# EasyEDA schematic pcb_schematic.json
TITLE: Space Modulation Project PCB Schematic; REV: 1.0; Date: 2024-11-21; Sheet: 1/1; Drawn By: sahelalsharu; Company: Your Company
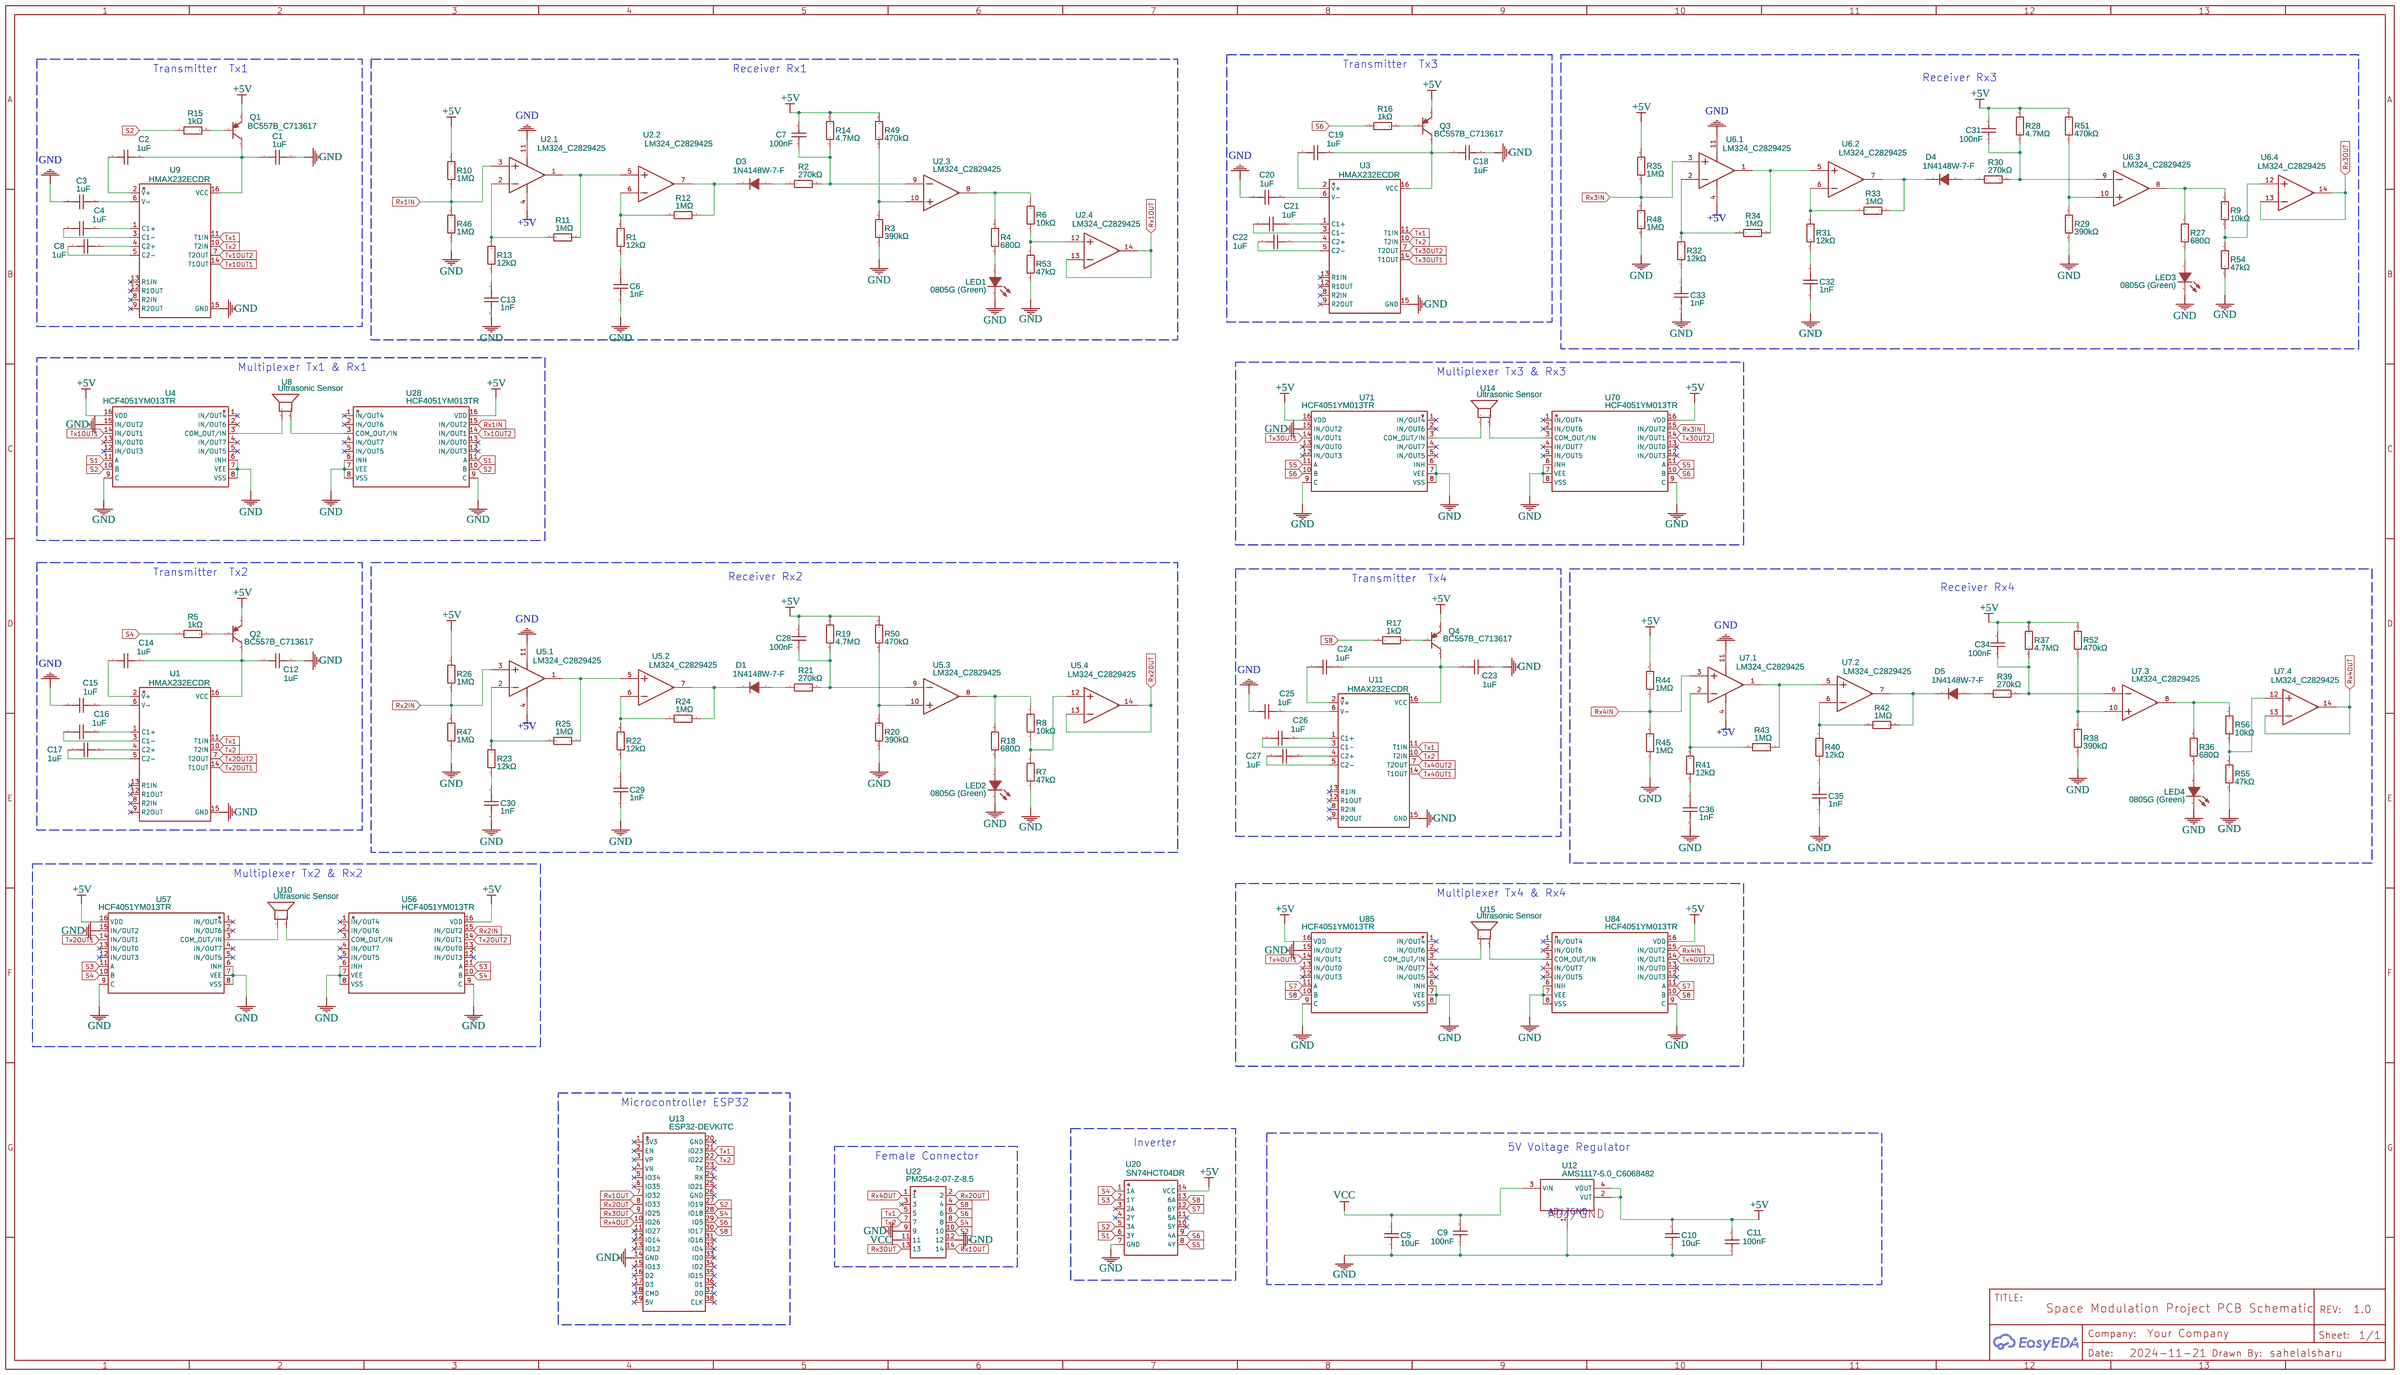
[diagram p0: schematic sheet]

## Parts
C1  1uF  [C1206]
C2  1uF  [C1206]
C3  1uF  [C1206]
C4  1uF  [C1206]
C5  10uF  [C1206]
C6  1nF  [C0805]
C7  100nF  [C0805]
C8  1uF  [C1206]
C9  100nF  [C0805]
C10  10uF  [C1206]
C11  100nF  [C0805]
C12  1uF  [C1206]
C13  1nF  [C0805]
C14  1uF  [C1206]
C15  1uF  [C1206]
C16  1uF  [C1206]
C17  1uF  [C1206]
C18  1uF  [C1206]
C19  1uF  [C1206]
C20  1uF  [C1206]
C21  1uF  [C1206]
C22  1uF  [C1206]
C23  1uF  [C1206]
C24  1uF  [C1206]
C25  1uF  [C1206]
C26  1uF  [C1206]
C27  1uF  [C1206]
C28  100nF  [C0805]
C29  1nF  [C0805]
C30  1nF  [C0805]
C31  100nF  [C0805]
C32  1nF  [C0805]
C33  1nF  [C0805]
C34  100nF  [C0805]
C35  1nF  [C0805]
C36  1nF  [C0805]
D1  1N4148W-7-F  [SOD-123_L2.7-W1.6-LS3.7-RD-1]
D3  1N4148W-7-F  [SOD-123_L2.7-W1.6-LS3.7-RD-1]
D4  1N4148W-7-F  [SOD-123_L2.7-W1.6-LS3.7-RD-1]
D5  1N4148W-7-F  [SOD-123_L2.7-W1.6-LS3.7-RD-1]
LED1  0805G (Green)  [LED0805-R-RD]
LED2  0805G (Green)  [LED0805-R-RD]
LED3  0805G (Green)  [LED0805-R-RD]
LED4  0805G (Green)  [LED0805-R-RD]
Q1  BC557B_C713617  [TO-92-3_L4.9-W3.7-P1.27-L]
Q2  BC557B_C713617  [TO-92-3_L4.9-W3.7-P1.27-L]
Q3  BC557B_C713617  [TO-92-3_L4.9-W3.7-P1.27-L]
Q4  BC557B_C713617  [TO-92-3_L4.9-W3.7-P1.27-L]
R1  12kΩ  [R0805]
R2  270kΩ  [R0805]
R3  390kΩ  [R0805]
R4  680Ω  [R0805]
R5  1kΩ  [R0805]
R6  10kΩ  [R0805]
R7  47kΩ  [R0805]
R8  10kΩ  [R0805]
R9  10kΩ  [R0805]
R10  1MΩ  [R0805]
R11  1MΩ  [R0805]
R12  1MΩ  [R0805]
R13  12kΩ  [R0805]
R14  4.7MΩ  [R0805]
R15  1kΩ  [R0805]
R16  1kΩ  [R0805]
R17  1kΩ  [R0805]
R18  680Ω  [R0805]
R19  4.7MΩ  [R0805]
R20  390kΩ  [R0805]
R21  270kΩ  [R0805]
R22  12kΩ  [R0805]
R23  12kΩ  [R0805]
R24  1MΩ  [R0805]
R25  1MΩ  [R0805]
R26  1MΩ  [R0805]
R27  680Ω  [R0805]
R28  4.7MΩ  [R0805]
R29  390kΩ  [R0805]
R30  270kΩ  [R0805]
R31  12kΩ  [R0805]
R32  12kΩ  [R0805]
R33  1MΩ  [R0805]
R34  1MΩ  [R0805]
R35  1MΩ  [R0805]
R36  680Ω  [R0805]
R37  4.7MΩ  [R0805]
R38  390kΩ  [R0805]
R39  270kΩ  [R0805]
R40  12kΩ  [R0805]
R41  12kΩ  [R0805]
R42  1MΩ  [R0805]
R43  1MΩ  [R0805]
R44  1MΩ  [R0805]
R45  1MΩ  [R0805]
R46  1MΩ  [R0805]
R47  1MΩ  [R0805]
R48  1MΩ  [R0805]
R49  470kΩ  [R0805]
R50  470kΩ  [R0805]
R51  470kΩ  [R0805]
R52  470kΩ  [R0805]
R53  47kΩ  [R0805]
R54  47kΩ  [R0805]
R55  47kΩ  [R0805]
R56  10kΩ  [R0805]
U1  HMAX232ECDR  [SOP-16_L10.2-W3.9-P1.27-LS6.0-BL]
U2  LM324_C2829425  [SOP-14_L8.6-W3.9-P1.27-LS6.0-BL]  (sections 1,2,3,4)
U3  HMAX232ECDR  [SOP-16_L10.2-W3.9-P1.27-LS6.0-BL]
U4  HCF4051YM013TR  [SO-16_L10.0-W4.0-P1.27-LS6.2-BL]
U5  LM324_C2829425  [SOP-14_L8.6-W3.9-P1.27-LS6.0-BL]  (sections 1,2,3,4)
U6  LM324_C2829425  [SOP-14_L8.6-W3.9-P1.27-LS6.0-BL]  (sections 1,2,3,4)
U7  LM324_C2829425  [SOP-14_L8.6-W3.9-P1.27-LS6.0-BL]  (sections 1,2,3,4)
U8  Ultrasonic Sensor  [ULTRASONIC SENSOR FOOTPRINT]
U9  HMAX232ECDR  [SOP-16_L10.2-W3.9-P1.27-LS6.0-BL]
U10  Ultrasonic Sensor  [ULTRASONIC SENSOR FOOTPRINT]
U11  HMAX232ECDR  [SOP-16_L10.2-W3.9-P1.27-LS6.0-BL]
U12  AMS1117-5.0_C6068482  [SOT-223-4_L6.5-W3.5-P2.30-LS7.0-BR]
U13  ESP32-DEVKITC  [BULETM-SMD_ESP32-DEVKITC]
U14  Ultrasonic Sensor  [ULTRASONIC SENSOR FOOTPRINT]
U15  Ultrasonic Sensor  [ULTRASONIC SENSOR FOOTPRINT]
U20  SN74HCT04DR  [SOIC-14_L8.7-W3.9-P1.27-LS6.0-BL]
U22  PM254-2-07-Z-8.5  [HDR-TH_14P-P2.54-V-F-R2-C7-S2.54]
U28  HCF4051YM013TR  [SO-16_L10.0-W4.0-P1.27-LS6.2-BL]
U56  HCF4051YM013TR  [SO-16_L10.0-W4.0-P1.27-LS6.2-BL]
U57  HCF4051YM013TR  [SO-16_L10.0-W4.0-P1.27-LS6.2-BL]
U70  HCF4051YM013TR  [SO-16_L10.0-W4.0-P1.27-LS6.2-BL]
U71  HCF4051YM013TR  [SO-16_L10.0-W4.0-P1.27-LS6.2-BL]
U84  HCF4051YM013TR  [SO-16_L10.0-W4.0-P1.27-LS6.2-BL]
U85  HCF4051YM013TR  [SO-16_L10.0-W4.0-P1.27-LS6.2-BL]

## Library data of the parts
C1-C4 C8 C12 C14-C27 = 1206B105K500NT: Supplier: LCSC; Manufacturer: FH(风华); Supplier Part: C90539; JLCPCB Part Class: Extended Part; link: https://lcsc.com/eda_search?q=C90539&%26type=1&ref=editor
C5 C10 = CL31A106KBHNNNE: Supplier: LCSC; Manufacturer: SAMSUNG(三星); Supplier Part: C13585; JLCPCB Part Class: Basic Part; link: https://lcsc.com/eda_search?q=C13585&%26type=1&ref=editor
C6 C13 C29 C30 C32 C33 C35 C36 = CC0805KRX7R9BB102: Supplier: LCSC; Manufacturer: YAGEO(国巨); Supplier Part: C94121; JLCPCB Part Class: Extended Part
C7 C9 C11 C28 C31 C34 = 0805B104K500NT: Supplier: LCSC; Manufacturer: FH(风华); Supplier Part: C38141; JLCPCB Part Class: Extended Part
D1 D3-D5 = 1N4148W-7-F: Supplier: LCSC; Manufacturer: DIODES(美台); Supplier Part: C83528; JLCPCB Part Class: Extended Part
LED1-LED4 = 0805G (Green): Supplier: LCSC; Manufacturer: KENTO; Manufacturer Part: KT-0805G; Supplier Part: C2297; JLCPCB Part Class: Basic Part
Q1-Q4 = BC557B_C713617: Contributor: LCSC; Supplier: LCSC; Supplier Part: C713617; Manufacturer: LGE(鲁光); Manufacturer Part: BC557B; JLCPCB Part Class: Extended Part
R1 R13 R22 R23 R31 R32 R40 R41 = 0805W8F1202T5E: Supplier: LCSC; Manufacturer: UNI-ROYAL(厚声); Supplier Part: C17444; JLCPCB Part Class: Basic Part
R2 R21 R30 R39 = 0805W8F2703T5E: Supplier: LCSC; Manufacturer: UNI-ROYAL(厚声); Supplier Part: C17589; JLCPCB Part Class: Extended Part
R3 R20 R29 R38 = 0805W8F3903T5E: Supplier: LCSC; Manufacturer: UNI-ROYAL(厚声); Supplier Part: C17656; JLCPCB Part Class: Extended Part
R4 R18 R27 R36 = 0805W8F6800T5E: Supplier: LCSC; Manufacturer: UNI-ROYAL(厚声); Supplier Part: C17798; JLCPCB Part Class: Basic Part
R5 R15-R17 = 0805W8F1001T5E: Supplier: LCSC; Manufacturer: UNI-ROYAL(厚声); Supplier Part: C17513; JLCPCB Part Class: Basic Part
R6 R8 R9 R56 = 0805W8F1002T5E: Supplier: LCSC; Manufacturer: UNI-ROYAL(厚声); Supplier Part: C17414; JLCPCB Part Class: Basic Part
R7 R53-R55 = RC0805FR-0747KL: Supplier: LCSC; Manufacturer: YAGEO(国巨); Supplier Part: C126351; JLCPCB Part Class: Extended Part
R10-R12 R24-R26 R33-R35 R42-R48 = 0805W8F1004T5E: Supplier: LCSC; Manufacturer: UNI-ROYAL(厚声); Supplier Part: C17514; JLCPCB Part Class: Basic Part
R14 R19 R28 R37 = 0805W8F4704T5E: Supplier: LCSC; Manufacturer: UNI-ROYAL(厚声); Supplier Part: C17674; JLCPCB Part Class: Extended Part
R49-R52 = 0805W8F4703T5E: Supplier: LCSC; Manufacturer: UNI-ROYAL(厚声); Supplier Part: C17709; JLCPCB Part Class: Basic Part
U1 U3 U9 U11 = HMAX232ECDR: Supplier: LCSC; Supplier Part: C22392678; Manufacturer: HXY MOSFET(华轩阳电子); JLCPCB Part Class: Extended Part; Contributor: lcsc
U2 U5-U7 = LM324_C2829425: subpart_no: 1; Supplier: LCSC; Supplier Part: C2829425; Manufacturer: CJ(江苏长电/长晶); Manufacturer Part: LM324; JLCPCB Part Class: Extended Part
U4 U28 U56 U57 U70 U71 U84 U85 = HCF4051YM013TR: Contributor: LCSC; Supplier: LCSC; Supplier Part: C443842; Manufacturer: ST(意法半导体); JLCPCB Part Class: Extended Part
U8 U10 U14 U15 = Ultrasonic Sensor: Contributor: sahelalsharu
U12 = AMS1117-5.0_C6068482: Supplier: LCSC; Supplier Part: C6068482; Manufacturer: GOODWORK(固得沃克); Manufacturer Part: AMS1117-5.0; JLCPCB Part Class: Extended Part; Contributor: lcsc; link: https://lcsc.com/eda_search?q=C6068482&%26type=1&ref=editor
U13 = ESP32-DEVKITC: Supplier: LCSC; Supplier Part: C571180; Manufacturer: ESPRESSIF(乐鑫); Manufacturer Part: ESP32-DevKitC; Contributor: lcsc; JLCPCB Part Class: Extended Part; Package Display: No
U20 = SN74HCT04DR: Supplier: LCSC; Manufacturer: TI(德州仪器); Supplier Part: C6766; JLCPCB Part Class: Extended Part
U22 = PM254-2-07-Z-8.5: Contributor: LCSC; Supplier: LCSC; Supplier Part: C2897408; Manufacturer: HCTL(华灿天禄); JLCPCB Part Class: Extended Part

## Nets
+5V: C7.2 C10.1 C11.2 C28.2 C31.2 C34.2 Q1.3(E) Q2.3(E) Q3.3(E) Q4.3(E) R10.2 R14.2 R19.2 R26.2 R28.2 R35.2 R37.2 R44.2 R49.2 R50.2 R51.2 R52.2 U2.4(VDD) U4.16(VDD) U5.4(VDD) U6.4(VDD) U7.4(VDD) U12.2(VUT) U12.4(VOUT) U20.14(VCC) U28.16(VDD) U56.16(VDD) U57.16(VDD) U70.16(VDD) U71.16(VDD) U84.16(VDD) U85.16(VDD)
GND: C1.2 C3.1 C5.2 C6.2 C9.1 C10.2 C11.1 C12.2 C13.2 C15.1 C18.2 C20.1 C23.2 C25.1 C29.2 C30.2 C32.2 C33.2 C35.2 C36.2 LED1.2(K) LED2.2(K) LED3.2(K) LED4.2(K) R3.1 R7.2 R20.1 R29.1 R38.1 R45.1 R46.1 R47.1 R48.1 R53.2 R54.2 R55.2 U1.15(GND) U2.11(VSS) U3.15(GND) U4.6(INH) U4.7(VEE) U4.8(VSS) U4.9(C) U4.15(IN/OUT2) U5.11(VSS) U6.11(VSS) U7.11(VSS) U9.15(GND) U11.15(GND) U12.1(ADJ/GND) U13.14(GND) U20.7(GND) U22.9 U22.12 U28.6(INH) U28.7(VEE) U28.8(VSS) U28.9(C) U56.6(INH) U56.7(VEE) U56.8(VSS) U56.9(C) U57.6(INH) U57.7(VEE) U57.8(VSS) U57.9(C) U57.15(IN/OUT2) U70.6(INH) U70.7(VEE) U70.8(VSS) U70.9(C) U71.6(INH) U71.7(VEE) U71.8(VSS) U71.9(C) U71.15(IN/OUT2) U84.6(INH) U84.7(VEE) U84.8(VSS) U84.9(C) U85.6(INH) U85.7(VEE) U85.8(VSS) U85.9(C) U85.15(IN/OUT2)
VCC: C5.1 C9.2 U12.3(VIN) U22.11
Rx1IN: R10.1 R46.2 U2.3(VINA+) U28.15(IN/OUT2)
Rx1OUT: U2.13(VIND-) U2.14(VOUTD) U13.7(IO32) U22.14
Rx2IN: R26.1 R47.2 U5.3(VINA+) U56.15(IN/OUT2)
Rx2OUT: U5.13(VIND-) U5.14(VOUTD) U13.8(IO33) U22.2
Rx3IN: R35.1 R48.2 U6.3(VINA+) U70.15(IN/OUT2)
Rx3OUT: U6.13(VIND-) U6.14(VOUTD) U13.9(IO25) U22.13
Rx4IN: R44.1 R45.2 U7.3(VINA+) U84.15(IN/OUT2)
Rx4OUT: U7.13(VIND-) U7.14(VOUTD) U13.10(IO26) U22.1
S1: U4.11(A) U20.6(3Y) U28.11(A)
S2: R15.1 U4.10(B) U13.27(IO19) U20.5(3A) U22.10 U28.10(B)
S3: U20.2(1Y) U56.11(A) U57.11(A)
S4: R5.1 U13.28(IO18) U20.1(1A) U22.8 U56.10(B) U57.10(B)
S5: U20.8(4Y) U70.11(A) U71.11(A)
S6: R16.1 U13.29(IO5) U20.9(4A) U22.6 U70.10(B) U71.10(B)
S7: U20.12(6Y) U84.11(A) U85.11(A)
S8: R17.1 U13.30(IO17) U20.13(6A) U22.4 U84.10(B) U85.10(B)
Tx1: U1.11(T1IN) U3.11(T1IN) U9.11(T1IN) U11.11(T1IN) U13.21(IO23) U22.5
Tx1OUT1: U4.14(IN/OUT1) U9.14(T1OUT)
Tx1OUT2: U9.7(T2OUT) U28.14(IN/OUT1)
Tx2: U1.10(T2IN) U3.10(T2IN) U9.10(T2IN) U11.10(T2IN) U13.22(IO22) U22.7
Tx2OUT1: U1.14(T1OUT) U57.14(IN/OUT1)
Tx2OUT2: U1.7(T2OUT) U56.14(IN/OUT1)
Tx3OUT1: U3.14(T1OUT) U71.14(IN/OUT1)
Tx3OUT2: U3.7(T2OUT) U70.14(IN/OUT1)
Tx4OUT1: U11.14(T1OUT) U85.14(IN/OUT1)
Tx4OUT2: U11.7(T2OUT) U84.14(IN/OUT1)
Net-(C1-1): C1.1 C2.2 Q1.1(C) U9.16(VCC)
Net-(C2-1): C2.1 U9.2(V+)
Net-(C3-2): C3.2 U9.6(V-)
Net-(C4-1): C4.1 U9.3(C1-)
Net-(C4-2): C4.2 U9.1(C1+)
Net-(C6-1): C6.1 R1.1
Net-(C7-1): C7.1 R2.2 R14.1 U2.9(VINC-)
Net-(C8-1): C8.1 U9.5(C2-)
Net-(C8-2): C8.2 U9.4(C2+)
Net-(C12-1): C12.1 C14.2 Q2.1(C) U1.16(VCC)
Net-(C13-1): C13.1 R13.1
Net-(C14-1): C14.1 U1.2(V+)
Net-(C15-2): C15.2 U1.6(V-)
Net-(C16-1): C16.1 U1.3(C1-)
Net-(C16-2): C16.2 U1.1(C1+)
Net-(C17-1): C17.1 U1.5(C2-)
Net-(C17-2): C17.2 U1.4(C2+)
Net-(C18-1): C18.1 C19.2 Q3.1(C) U3.16(VCC)
Net-(C19-1): C19.1 U3.2(V+)
Net-(C20-2): C20.2 U3.6(V-)
Net-(C21-1): C21.1 U3.3(C1-)
Net-(C21-2): C21.2 U3.1(C1+)
Net-(C22-1): C22.1 U3.5(C2-)
Net-(C22-2): C22.2 U3.4(C2+)
Net-(C23-1): C23.1 C24.2 Q4.1(C) U11.16(VCC)
Net-(C24-1): C24.1 U11.2(V+)
Net-(C25-2): C25.2 U11.6(V-)
Net-(C26-1): C26.1 U11.3(C1-)
Net-(C26-2): C26.2 U11.1(C1+)
Net-(C27-1): C27.1 U11.5(C2-)
Net-(C27-2): C27.2 U11.4(C2+)
Net-(C28-1): C28.1 R19.1 R21.2 U5.9(VINC-)
Net-(C29-1): C29.1 R22.1
Net-(C30-1): C30.1 R23.1
Net-(C31-1): C31.1 R28.1 R30.2 U6.9(VINC-)
Net-(C32-1): C32.1 R31.1
Net-(C33-1): C33.1 R32.1
Net-(C34-1): C34.1 R37.1 R39.2 U7.9(VINC-)
Net-(C35-1): C35.1 R40.1
Net-(C36-1): C36.1 R41.1
Net-(D1-1): D1.1(C) R24.1 U5.7(VOUTB)
Net-(D1-2): D1.2(A) R21.1
Net-(D3-1): D3.1(C) R12.1 U2.7(VOUTB)
Net-(D3-2): D3.2(A) R2.1
Net-(D4-1): D4.1(C) R33.1 U6.7(VOUTB)
Net-(D4-2): D4.2(A) R30.1
Net-(D5-1): D5.1(C) R42.1 U7.7(VOUTB)
Net-(D5-2): D5.2(A) R39.1
Net-(LED1-1): LED1.1(A) R4.1
Net-(LED2-1): LED2.1(A) R18.1
Net-(LED3-1): LED3.1(A) R27.1
Net-(LED4-1): LED4.1(A) R36.1
Net-(Q1-2): Q1.2(B) R15.2
Net-(Q2-2): Q2.2(B) R5.2
Net-(Q3-2): Q3.2(B) R16.2
Net-(Q4-2): Q4.2(B) R17.2
Net-(R1-2): R1.2 R12.2 U2.6(VINB-)
Net-(R3-2): R3.2 R49.1 U2.10(VINC+)
Net-(R4-2): R4.2 R6.2 U2.8(VOUTC)
Net-(R6-1): R6.1 R53.1 U2.12(VIND+)
Net-(R7-1): R7.1 R8.1 U5.12(VIND+)
Net-(R8-2): R8.2 R18.2 U5.8(VOUTC)
Net-(R9-1): R9.1 R54.1 U6.12(VIND+)
Net-(R9-2): R9.2 R27.2 U6.8(VOUTC)
Net-(R11-1): R11.1 U2.1(VOUTA) U2.5(VINB+)
Net-(R11-2): R11.2 R13.2 U2.2(VINA-)
Net-(R20-2): R20.2 R50.1 U5.10(VINC+)
Net-(R22-2): R22.2 R24.2 U5.6(VINB-)
Net-(R23-2): R23.2 R25.2 U5.2(VINA-)
Net-(R25-1): R25.1 U5.1(VOUTA) U5.5(VINB+)
Net-(R29-2): R29.2 R51.1 U6.10(VINC+)
Net-(R31-2): R31.2 R33.2 U6.6(VINB-)
Net-(R32-2): R32.2 R34.2 U6.2(VINA-)
Net-(R34-1): R34.1 U6.1(VOUTA) U6.5(VINB+)
Net-(R36-2): R36.2 R56.2 U7.8(VOUTC)
Net-(R38-2): R38.2 R52.1 U7.10(VINC+)
Net-(R40-2): R40.2 R42.2 U7.6(VINB-)
Net-(R41-2): R41.2 R43.2 U7.2(VINA-)
Net-(R43-1): R43.1 U7.1(VOUTA) U7.5(VINB+)
Net-(R55-1): R55.1 R56.1 U7.12(VIND+)
Net-(U4-3): U4.3(COM OUT/IN) U8.1
Net-(U8-2): U8.2 U28.3(COM OUT/IN)
Net-(U10-1): U10.1 U57.3(COM OUT/IN)
Net-(U10-2): U10.2 U56.3(COM OUT/IN)
Net-(U14-1): U14.1 U71.3(COM OUT/IN)
Net-(U14-2): U14.2 U70.3(COM OUT/IN)
Net-(U15-1): U15.1 U85.3(COM OUT/IN)
Net-(U15-2): U15.2 U84.3(COM OUT/IN)

Not connected (* = marked no-connect by the designer): U1 8(R2IN)* 9(R2OUT)* 12(R1OUT)* 13(R1IN)*; U3 8(R2IN)* 9(R2OUT)* 12(R1OUT)* 13(R1IN)*; U4 1(IN/OUT4)* 2(IN/OUT6)* 4(IN/OUT7)* 5(IN/OUT5)* 12(IN/OUT3)* 13(IN/OUT0)*; U9 8(R2IN)* 9(R2OUT)* 12(R1OUT)* 13(R1IN)*; U11 8(R2IN)* 9(R2OUT)* 12(R1OUT)* 13(R1IN)*; U13 1(3V3)* 2(EN)* 3(VP)* 4(VN)* 5(IO34)* 6(IO35)* 11(IO27)* 12(IO14)* 13(IO12)* 15(IO13)* 16(D2)* 17(D3)* 18(CMD)* 19(5V)* 20(GND)* 23(TX)* 24(RX)* 25(IO21)* 26(GND)* 31(IO16)* 32(IO4)* 33(IO0)* 34(IO2)* 35(IO15)* 36(D1)* 37(D0)* 38(CLK)*; U20 3(2A)* 4(2Y)* 10(5Y)* 11(5A)*; U22 3*; U28 1(IN/OUT4)* 2(IN/OUT6)* 4(IN/OUT7)* 5(IN/OUT5)* 12(IN/OUT3)* 13(IN/OUT0)*; U56 1(IN/OUT4)* 2(IN/OUT6)* 4(IN/OUT7)* 5(IN/OUT5)* 12(IN/OUT3)* 13(IN/OUT0)*; U57 1(IN/OUT4)* 2(IN/OUT6)* 4(IN/OUT7)* 5(IN/OUT5)* 12(IN/OUT3)* 13(IN/OUT0)*; U70 1(IN/OUT4)* 2(IN/OUT6)* 4(IN/OUT7)* 5(IN/OUT5)* 12(IN/OUT3)* 13(IN/OUT0)*; U71 1(IN/OUT4)* 2(IN/OUT6)* 4(IN/OUT7)* 5(IN/OUT5)* 12(IN/OUT3)* 13(IN/OUT0)*; U84 1(IN/OUT4)* 2(IN/OUT6)* 4(IN/OUT7)* 5(IN/OUT5)* 12(IN/OUT3)* 13(IN/OUT0)*; U85 1(IN/OUT4)* 2(IN/OUT6)* 4(IN/OUT7)* 5(IN/OUT5)* 12(IN/OUT3)* 13(IN/OUT0)*

## Notes on the sheet
- Transmitter  Tx3
- Transmitter  Tx1
- Receiver Rx1
- Receiver Rx3
- Multiplexer Tx1 & Rx1
- Multiplexer Tx3 & Rx3
- Transmitter  Tx2
- Receiver Rx2
- Transmitter  Tx4
- Receiver Rx4
- Multiplexer Tx2 & Rx2
- Multiplexer Tx4 & Rx4
- Microcontroller ESP32
- Inverter
- 5V Voltage Regulator
- Female Connector
- ADJ/GND
